# Altium schematic sheet H-bridge and gate drivers.SchDoc: H-bridge and gate drivers
size Letter; DrawnBy: K Hong; SheetNumber: 1; SheetTotal: 2
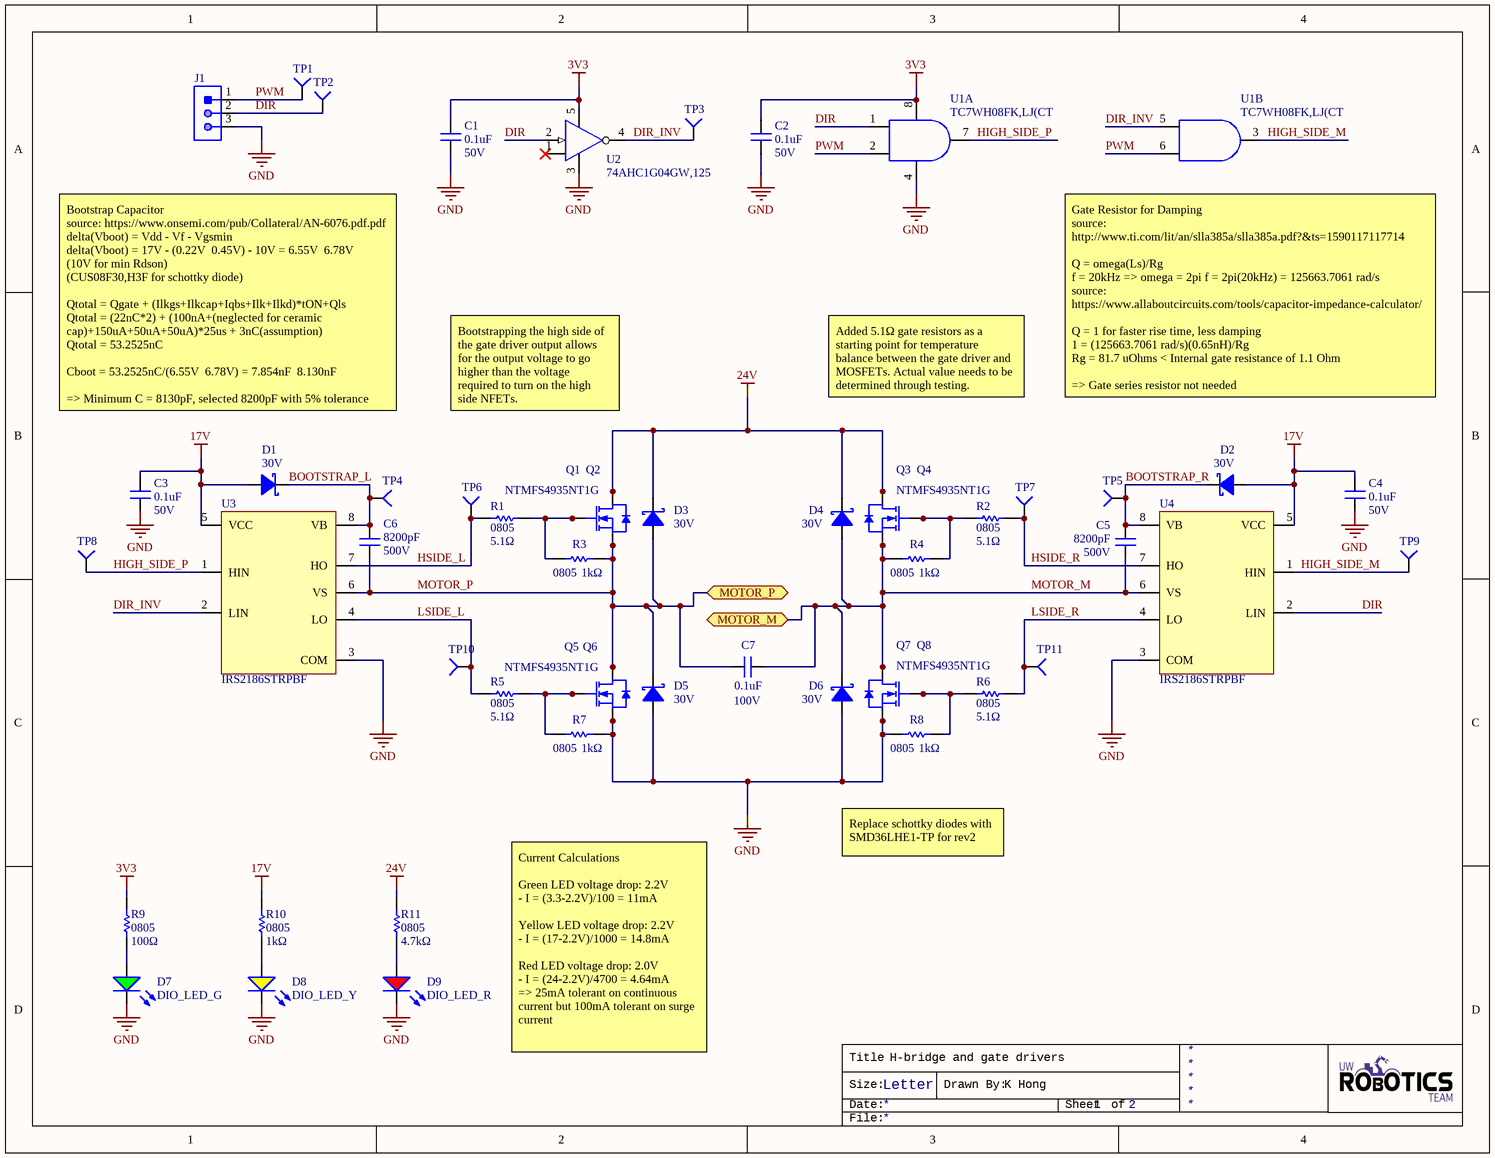
[diagram p0: H-bridge and gate drivers.SchDoc]

## Parts
C1  value 0.1uF  Voltage Rating: 50V  [CAPC2012X140N]  (hidden comment: CAP_0.1uF_50V_0805)
C2  value 0.1uF  Voltage Rating: 50V  [CAPC2012X140N]  (hidden comment: CAP_0.1uF_50V_0805)
C3  value 0.1uF  Voltage Rating: 50V  [CAPC2012X140N]  (hidden comment: CAP_0.1uF_50V_0805)
C4  value 0.1uF  Voltage Rating: 50V  [CAPC2012X140N]  (hidden comment: CAP_0.1uF_50V_0805)
C5  Capacitance: 8200pF  Voltage Rating (DC): 500V  [CAPC1206(3216)]  (hidden comment: CAP_8200pF_500V_1206)
C6  Capacitance: 8200pF  Voltage Rating (DC): 500V  [CAPC1206(3216)]  (hidden comment: CAP_8200pF_500V_1206)
C7  Capacitance: 0.1uF  Voltage(DC): 100V  [MKS2D031001A00MSSD]  (hidden comment: CAP_0.1uF_100V_FILM)
D1  Vr (Max): 30V  [SOD-323_UNIDIR]  (hidden comment: DIO_SCHOTTKY_30V_800mA)
D2  Vr (Max): 30V  [SOD-323_UNIDIR]  (hidden comment: DIO_SCHOTTKY_30V_800mA)
D3  Vr (Max): 30V  [SOD-323_UNIDIR]  (hidden comment: DIO_SCHOTTKY_30V_800mA)
D4  Vr (Max): 30V  [SOD-323_UNIDIR]  (hidden comment: DIO_SCHOTTKY_30V_800mA)
D5  Vr (Max): 30V  [SOD-323_UNIDIR]  (hidden comment: DIO_SCHOTTKY_30V_800mA)
D6  Vr (Max): 30V  [SOD-323_UNIDIR]  (hidden comment: DIO_SCHOTTKY_30V_800mA)
D7  DIO_LED_G  [LED_0805_LINE]
D8  DIO_LED_Y  [LED_0805_LINE]
D9  DIO_LED_R  [LED_0805_LINE]
J1  CON_3M_TERM  [1935174]  (value not drawn)
Q1  NTMFS4935NT1G  [SO8-FL]  (value not drawn)
Q2  NTMFS4935NT1G  [SO8-FL]
Q3  NTMFS4935NT1G  [SO8-FL]
Q4  NTMFS4935NT1G  [SO8-FL]  (value not drawn)
Q5  NTMFS4935NT1G  [SO8-FL]  (value not drawn)
Q6  NTMFS4935NT1G  [SO8-FL]
Q7  NTMFS4935NT1G  [SO8-FL]  (value not drawn)
Q8  NTMFS4935NT1G  [SO8-FL]
R1  value 5.1Ω  Case Code (Imperial): 0805  [RESC2013X70X40LL20T20]  (hidden comment: RES_5.1Ω_0805)
R2  value 5.1Ω  Case Code (Imperial): 0805  [RESC2013X70X40LL20T20]  (hidden comment: RES_5.1Ω_0805)
R3  value 1kΩ  Case Code (Imperial): 0805  [RESC2012X60N]  (hidden comment: RES_1kΩ_0805)
R4  value 1kΩ  Case Code (Imperial): 0805  [RESC2012X60N]  (hidden comment: RES_1kΩ_0805)
R5  value 5.1Ω  Case Code (Imperial): 0805  [RESC2013X70X40LL20T20]  (hidden comment: RES_5.1Ω_0805)
R6  value 5.1Ω  Case Code (Imperial): 0805  [RESC2013X70X40LL20T20]  (hidden comment: RES_5.1Ω_0805)
R7  value 1kΩ  Case Code (Imperial): 0805  [RESC2012X60N]  (hidden comment: RES_1kΩ_0805)
R8  value 1kΩ  Case Code (Imperial): 0805  [RESC2012X60N]  (hidden comment: RES_1kΩ_0805)
R9  value 100Ω  Case Code (Imperial): 0805  [RESC2012X60N]  (hidden comment: RES_100Ω_0805)
R10  value 1kΩ  Case Code (Imperial): 0805  [RESC2012X60N]  (hidden comment: RES_1kΩ_0805)
R11  value 4.7kΩ  Case Code (Imperial): 0805  [RESC2012X60N]  (hidden comment: RES_4.7kΩ_0805)
TP1  TESTPOINT_SMD  [TESTPOINT]  (value not drawn)
TP2  TESTPOINT_SMD  [TESTPOINT]  (value not drawn)
TP3  TESTPOINT_SMD  [TESTPOINT]  (value not drawn)
TP4  TESTPOINT_SMD  [TESTPOINT]  (value not drawn)
TP5  TESTPOINT_SMD  [TESTPOINT]  (value not drawn)
TP6  TESTPOINT_SMD  [TESTPOINT]  (value not drawn)
TP7  TESTPOINT_SMD  [TESTPOINT]  (value not drawn)
TP8  TESTPOINT_SMD  [TESTPOINT]  (value not drawn)
TP9  TESTPOINT_SMD  [TESTPOINT]  (value not drawn)
TP10  TESTPOINT_SMD  [TESTPOINT]  (value not drawn)
TP11  TESTPOINT_SMD  [TESTPOINT]  (value not drawn)
U1  TC7WH08FK,LJ(CT  [8-VFSOP]  (parts A,B of 2)
U2  74AHC1G04GW,125  [SOT353]
U3  IRS2186STRPBF  [8-SOIC_M]
U4  IRS2186STRPBF  [8-SOIC_M]

## Ports
MOTOR_M (bidir), MOTOR_P (bidir)

## Nets
3V3: C1.2 C2.2 R9.2 U1.8(Vcc) U2.5(Vcc)
17V: C3.2 C4.2 D1.1(Anode) D2.1(Anode) R10.2 U3.5(VCC) U4.5(VCC)
24V: D3.2(Cathode) D4.2(Cathode) Q1.3(Drain) Q2.3(Drain) Q3.3(Drain) Q4.3(Drain) R11.2
GND: C1.1 C2.1 C3.1 C4.1 D5.1(Anode) D6.1(Anode) D7.2(K) D8.2(K) D9.2(K) J1.3 Q5.1(Source) Q6.1(Source) Q7.1(Source) Q8.1(Source) R7.2 R8.1 U1.4(GND) U2.3(GND) U3.3(COM) U4.3(COM)
BOOTSTRAP_L: C6.2 D1.2(Cathode) TP4.1(=value) U3.8(VB)
BOOTSTRAP_R: C5.2 D2.2(Cathode) TP5.1(=value) U4.8(VB)
DIR: J1.2 TP2.1(=value) U1.1(A1) U2.2(A) U4.2(LIN)
DIR_INV: TP3.1(=value) U1.5(A2) U2.4(Y) U3.2(LIN)
HIGH_SIDE_M: TP9.1(=value) U1.3(Y2) U4.1(HIN)
HIGH_SIDE_P: TP8.1(=value) U1.7(Y1) U3.1(HIN)
HSIDE_L: R1.1 TP6.1(=value) U3.7(HO)
HSIDE_R: R2.2 TP7.1(=value) U4.7(HO)
LSIDE_L: R5.1 TP10.1(=value) U3.4(LO)
LSIDE_R: R6.2 TP11.1(=value) U4.4(LO)
MOTOR_M: C5.1 C7.2 D4.1(Anode) D6.2(Cathode) Q3.1(Source) Q4.1(Source) Q7.3(Drain) Q8.3(Drain) R4.1 U4.6(VS) ; port MOTOR_M
MOTOR_P: C6.1 C7.1 D3.1(Anode) D5.2(Cathode) Q1.1(Source) Q2.1(Source) Q5.3(Drain) Q6.3(Drain) R3.2 U3.6(VS) ; port MOTOR_P
PWM: J1.1 TP1.1(=value) U1.2(B1) U1.6(B2)
NetD7_1: D7.1(A) R9.1
NetD8_1: D8.1(A) R10.1
NetD9_1: D9.1(A) R11.1
NetQ1_2: Q1.2(Gate) Q2.2(Gate) R1.2 R3.1
NetQ3_2: Q3.2(Gate) Q4.2(Gate) R2.1 R4.2
NetQ5_2: Q5.2(Gate) Q6.2(Gate) R5.2 R7.1
NetQ7_2: Q7.2(Gate) Q8.2(Gate) R6.1 R8.2

Not connected (* = marked no-connect by the designer): U2 1(NC)*

## Notes on the sheet
- Bootstrap Capacitor
  source: https://www.onsemi.com/pub/Collateral/AN-6076.pdf.pdf
  delta(Vboot) = Vdd - Vf - Vgsmin
  delta(Vboot) = 17V - (0.22V  0.45V) - 10V = 6.55V  6.78V
  (10V for min Rdson)
  (CUS08F30,H3F for schottky diode)
  Qtotal = Qgate + (Ilkgs+Ilkcap+Iqbs+Ilk+Ilkd)*tON+Qls
  Qtotal = (22nC*2) + (100nA+(neglected for ceramic cap)+150uA+50uA+50uA)*25us + 3nC(assumption)
  Qtotal = 53.2525nC
  Cboot = 53.2525nC/(6.55V  6.78V) = 7.854nF  8.130nF
  => Minimum C = 8130pF, selected 8200pF with 5% tolerance
- Bootstrapping the high side of the gate driver output allows for the output voltage to go higher than the voltage required to turn on the high side NFETs.
- Added 5.1Ω gate resistors as a starting point for temperature balance between the gate driver and MOSFETs. Actual value needs to be determined through testing.
- (near U1) Gate Resistor for Damping
  source: http://www.ti.com/lit/an/slla385a/slla385a.pdf?&ts=1590117117714
  Q = omega(Ls)/Rg
  f = 20kHz => omega = 2pi f = 2pi(20kHz) = 125663.7061 rad/s
  source: https://www.allaboutcircuits.com/tools/capacitor-impedance-calculator/
  Q = 1 for faster rise time, less damping
  1 = (125663.7061 rad/s)(0.65nH)/Rg
  Rg = 81.7 uOhms < Internal gate resistance of 1.1 Ohm
  => Gate series resistor not needed
- Replace schottky diodes with SMD36LHE1-TP for rev2
- Current Calculations
  Green LED voltage drop: 2.2V
  - I = (3.3-2.2V)/100 = 11mA
  Yellow LED voltage drop: 2.2V
  - I = (17-2.2V)/1000 = 14.8mA
  Red LED voltage drop: 2.0V
  - I = (24-2.2V)/4700 = 4.64mA
  => 25mA tolerant on continuous current but 100mA tolerant on surge current
- Title
- Size:
- Date:
- Letter
- Drawn By:
- Sheet
- of
- File:

## Library data of the parts
C1-C4 = CAP_0.1uF_50V_0805: CAP CER 0.1UF 50V X7R 0805; Manufacturer 1: Murata Electronics; Manufacturer Part Number 1: GCD21BR71H104KA01L; Capacitance: 100nF; Tolerance: 10%; Mount: Surface Mount; Case/Package: 0805; Case Code (Metric): 2012; Case Code (Imperial): 0805; Min Operating Temperature: -55°C; Max Operating Temperature: 125°C; Dielectric: X7R; Termination: SMD/SMT; Length: 2mm; Height: 1.25mm; Width: 0.049inch; Thickness: 0.049inch; Depth: 1.25mm; Ratings: AEC-Q200; ComponentLink1URL: https://datasheet.ciiva.com/29537/c03e-29537701.pdf?src-supplier=Digi-Key; ComponentLink1Description: https://datasheet.ciiva.com/29537/c03e-29537701.pdf?src-supplier=Digi-Key; Supplier 1: Digi-Key; Supplier Part Number 1: 490-11955-1-ND
C5 C6 = CAP_8200pF_500V_1206: Cap 0.0082uF 500Vdc C0G 5% SMD 1206 125°C Paper T/R; Manufacturer 1: KEMET; Manufacturer Part Number 1: C1206C822JCGACAUTO; Supplier 1: Digi-Key; RoHS: No; Category: Ceramic Capacitors; Stock 1: 2611; Pricing 1: 1=0.45000, 10=0.31800, 100=0.20960, 500=0.15528, 1000=0.13198 (USD); Tolerance: 5%; ComponentLink1URL: https://datasheet.ciiva.com:443/pdfs/VipMasterIC/IC/KEME/KEME-S-A0008958438/KEME-S-A0008958438-1.pdf?src-supplier=IHS+Markit; ComponentLink1Description: https://datasheet.ciiva.com:443/pdfs/VipMasterIC/IC/KEME/KEME-S-A0008958438/KEME-S-A0008958438-1.pdf?src-supplier=IHS+Markit; Supplier Part Number 1: 399-14847-1-ND; ComponentLink2URL: http://www.farnell.com/datasheets/2746514.pdf?src-supplier=Farnell; ComponentLink2Description: http://www.farnell.com/datasheets/2746514.pdf?src-supplier=Farnell; ComponentLink3URL: http://www.farnell.com/datasheets/2746514.pdf?src-supplier=Newark; ComponentLink3Description: http://www.farnell.com/datasheets/2746514.pdf?src-supplier=Newark; Package: 1206
C7 = CAP_0.1uF_100V_FILM: CAP FILM 0.1UF 100V RADIAL; Manufacturer 1: WIMA; Tolerance: 20%; Dielectric: PET; Lead Diameter: 0.5mm; Voltage(AC): 63V; Case/Package: Radial; Min Operating Temperature: -55°C; Max Operating Temperature: 100°C; Length: 7.2mm; Depth: 2.5mm; ComponentLink1URL: https://datasheet.ciiva.com:443/pdfs/VipMasterIC/IC/WIMA/WIMA-S-A0007419204/WIMA-S-A0007419204-1.pdf?src-supplier=IHS+Markit; ComponentLink1Description: https://datasheet.ciiva.com:443/pdfs/VipMasterIC/IC/WIMA/WIMA-S-A0007419204/WIMA-S-A0007419204-1.pdf?src-supplier=IHS+Markit; Supplier 1: Digi-Key; Supplier Part Number 1: 1928-1656-ND; Manufacturer Part Number 1: MKS2D031001A00MSSD; RoHS: Yes; Category: Film Capacitors; Stock 1: 4135; Pricing 1: 1=0.43000, 10=0.30000, 100=0.17970, 500=0.13478, 1000=0.11381, 2500=0.10782, 5000=0.10183 (USD); Packaging: Bulk; Lead Pitch: 5mm; Radiation Hardening: No; ComponentLink2URL: https://datasheet.ciiva.com/26863/getdatasheetpartid-403283-26863662.pdf?src-supplier=Verical; ComponentLink2Description: https://datasheet.ciiva.com/26863/getdatasheetpartid-403283-26863662.pdf?src-supplier=Verical
D1-D6 = DIO_SCHOTTKY_30V_800mA: DIODE SCHOTTKY 30V 800MA USC; Manufacturer 1: Toshiba Semiconductor and Storage; Manufacturer Part Number 1: CUS08F30,H3F; Vf (Max): 220mV; Supplier 1: Digi-Key; Supplier Part Number 1: CUS08F30H3FCT-ND; Mount: Surface Mount; Io: 800mA
D7 = DIO_LED_G: LED GREEN DIFFUSED 0805 SMD; Manufacturer Part Number 1: LG R971-KN-1; Manufacturer 1: OSRAM; Forward Voltage Drop: 2.2V; Package: 0805 (2012 Metric); Supplier Part Number 1: 475-1410-1-ND; Supplier 1: Digi-Key; Mount: Surface Mount
D8 = DIO_LED_Y: LED YELLOW DIFFUSED 0805 SMD; Manufacturer Part Number 1: LY R976-PS-36; Manufacturer 1: OSRAM; Forward Voltage Drop: 2.2V; Package: 0805 (2012 Metric); Supplier Part Number 1: 475-2560-1-ND; Supplier 1: Digi-Key; Mount: Surface Mount
D9 = DIO_LED_R: LED RED DIFFUSED 0805 SMD; Manufacturer Part Number 1: LS R976-NR-1; Manufacturer 1: OSRAM; Forward Voltage Drop: 2V; Package: 0805 (2012 Metric); Supplier Part Number 1: 475-1278-1-ND; Supplier 1: Digi-Key; Mount: Surface Mount
J1 = CON_3M_TERM: TERM BLK 3POS SIDE ENTRY 5MM; Manufacturer 1: Phoenix Contact; Number of Contacts: 3; Voltage Rating (DC): 320V; Number of Levels: 1; Current: 18A; Voltage: 300V; Max Current Rating: 16A; Voltage Rating: 250V; Current Rating: 17.5A; Wire Gauge (Max): 26AWG; Wire Gauge (Min): 12AWG; Approvals: UL,VDE,CB; Supplier 1: Digi-Key; Supplier Part Number 1: 277-1578-ND; Manufacturer Part Number 1: 1935174; Mount: Through Hole; RoHS: Yes; Category: Terminal Blocks; Stock 1: 25144; Pricing 1: 1=0.60000, 10=0.58000, 50=0.55440, 100=0.53930, 250=0.50400, 500=0.46368, 1000=0.42840, 2500=0.42838 (USD); Number of Pins: 3; Weight: 0.100531oz; Contact Material: Copper,Tin; Color: Green; Insulation Material: Nylon; Housing Material: Polyamide; Material: Nylon; Housing Color: Green; Termination: Solder; Packaging: Bulk; Orientation: Straight; Number of Positions Per Level: 3; Number of Positions: 3; Number of Circuits: 3; Package Quantity: 250; Number of Poles: 3; Number of Rows: 1; Max Supply Voltage: 250V; Length: 9mm; Height: 11.3mm; Pitch: 5mm; Depth: 9mm; Stripping Length: 5mm; Width: 15mm; Wire/Cable Gauge: 26AWG; Radiation Hardening: No; REACH SVHC: Unknown; Flammability Rating: UL94 V-0; Lead Free: Lead Free; ComponentLink1URL: https://datasheet.ciiva.com:443/pdfs/VipMasterIC/IC/PCON/PCON-S-A0007661889/PCON-S-A0008047997-1.pdf?src-supplier=IHS+Markit; ComponentLink1Description: https://datasheet.ciiva.com:443/pdfs/VipMasterIC/IC/PCON/PCON-S-A0007661889/PCON-S-A0008047997-1.pdf?src-supplier=IHS+Markit; ComponentLink2URL: https://datasheet.ciiva.com/16047/1935174-16047249.pdf?src-supplier=Onlinecomponents.com; ComponentLink2Description: https://datasheet.ciiva.com/16047/1935174-16047249.pdf?src-supplier=Onlinecomponents.com; ComponentLink3URL: https://datasheet.ciiva.com/15169/getdatasheetpartid-212213-15169949.pdf?src-supplier=Verical; ComponentLink3Description: https://datasheet.ciiva.com/15169/getdatasheetpartid-212213-15169949.pdf?src-supplier=Verical; ComponentLink4URL: https://datasheet.ciiva.com/823/combiconcompact5-0mmseries-823761.pdf?src-supplier=Digi-Key; ComponentLink4Description: https://datasheet.ciiva.com/823/combiconcompact5-0mmseries-823761.pdf?src-supplier=Digi-Key; ComponentLink5URL: https://datasheet.ciiva.com/29218/744167-da-01-en-printklemme-pt-1-5-3-5-0-h-29218252.pdf?src-supplier=Conrad; ComponentLink5Description: https://datasheet.ciiva.com/29218/744167-da-01-en-printklemme-pt-1-5-3-5-0-h-29218252.pdf?src-supplier=Conrad
Q1-Q8 = NTMFS4935NT1G: MOSFET N-CH 30V 13A SO8FL; Manufacturer 1: ON Semiconductor; Continuous Drain Current (ID): 93A; Drain to Source Resistance: 3.2mR; Power Dissipation: 2.63W; Max Power Dissipation: 48W; Threshold Voltage: 1.63V; Turn-On Delay Time: 16.3ns; Turn-Off Delay Time: 27.5ns; Fall Time: 6.6ns; Number of Elements: 1; Input Capacitance: 4.85nF; Rise Time: 20ns; Element Configuration: Single; Gate to Source Voltage (Vgs): 20V; Supplier 1: Digi-Key; RoHS: Yes; Category: MOSFETs; Stock 1: 10192; Pricing 1: 1=0.87000, 10=0.76800, 25=0.72160, 100=0.52380, 250=0.50516, 500=0.43766 (USD); Case/Package: SO; Number of Pins: 5; Contact Plating: Tin,Matte; Min Operating Temperature: -55°C; Max Operating Temperature: 150°C; Drain to Source Breakdown Voltage: 30V; Drain to Source Voltage (Vdss): 30V; Nominal Vgs: 1.63V; Package Quantity: 1; Rds On Max: 3.2mR; Packaging: Tape and Reel; Length: 5.1mm; Height: 1.1mm; Width: 6.1mm; Radiation Hardening: No; Lead Free: Lead Free; REACH SVHC: No SVHC; ComponentLink1URL: https://datasheet.ciiva.com:443/pdfs/VipMasterIC/IC/ONSM/ONSM-S-A0008367025/ONSM-S-A0008367025-1.pdf?src-supplier=IHS+Markit; ComponentLink1Description: https://datasheet.ciiva.com:443/pdfs/VipMasterIC/IC/ONSM/ONSM-S-A0008367025/ONSM-S-A0008367025-1.pdf?src-supplier=IHS+Markit; ComponentLink2URL: https://datasheet.ciiva.com/22641/1707323-22641681.pdf?src-supplier=Element14; ComponentLink2Description: https://datasheet.ciiva.com/22641/1707323-22641681.pdf?src-supplier=Element14; ComponentLink3URL: https://datasheet.ciiva.com/947/ntmfs4935n-d-947308.pdf?src-supplier=Digi-Key; ComponentLink3Description: https://datasheet.ciiva.com/947/ntmfs4935n-d-947308.pdf?src-supplier=Digi-Key; ComponentLink4URL: https://datasheet.ciiva.com/11166/ntmfs4935n-d-11166461.pdf?src-supplier=Avnet; ComponentLink4Description: https://datasheet.ciiva.com/11166/ntmfs4935n-d-11166461.pdf?src-supplier=Avnet; ComponentLink5URL: https://datasheet.ciiva.com/947/ntmfs4935n-d-947310.pdf?src-supplier=Digi-Key; ComponentLink5Description: https://datasheet.ciiva.com/947/ntmfs4935n-d-947310.pdf?src-supplier=Digi-Key; ComponentLink6URL: https://datasheet.ciiva.com/947/ntmfs4935n-d-947309.pdf?src-supplier=Digi-Key; ComponentLink6Description: https://datasheet.ciiva.com/947/ntmfs4935n-d-947309.pdf?src-supplier=Digi-Key; Supplier Part Number 1: NTMFS4935NT1GOSCT-ND
  Q2 Q3 Q6 Q8: Manufacturer Part Number 1: NTMFS4935NT1G
R1 R2 R5 R6 = RES_5.1Ω_0805: RES SMD 5.1 OHM 5% 1/8W 0805; Manufacturer 1: Panasonic; Manufacturer Part Number 1: ERJ-6GEYJ5R1V; Supplier 1: Digi-Key; Supplier Part Number 1: P5.1ACT-ND; Mount: Surface Mount; Case Code (Metric): 2012
R3 R4 R7 R8 R10 = RES_1kΩ_0805: RES SMD 1K OHM 1% 1/8W 0805; Manufacturer 1: Yageo; Manufacturer Part Number 1: RC0805FR-071KL; Power Rating: 125mW; Supplier 1: Digi-Key; Case Code (Metric): 2012; Min Operating Temperature: -55°C; Max Operating Temperature: 155°C; Resistance: 1K; Tolerance: 1%; Termination: SMD/SMT; Supplier Part Number 1: 311-1.00KCRCT-ND
R9 = RES_100Ω_0805: RES SMD 100 OHM 1% 1/8W 0805; Manufacturer 1: Yageo; Manufacturer Part Number 1: RC0805FR-07100RL; Power Rating: 125mW; Supplier 1: Digi-Key; Mount: Surface Mount; Case Code (Metric): 2012; Supplier Part Number 1: 311-100CRCT-ND
R11 = RES_4.7kΩ_0805: RES SMD 4.7K OHM 5% 1/8W 0805; Manufacturer 1: Yageo; Manufacturer Part Number 1: RC0805JR-074K7L; Resistance: 4.7kR; Power Rating: 125mW; Temperature Coefficient: 100ppm/°C; Voltage Rating: 150V; Supplier 1: Digi-Key; Case Code (Metric): 2012; Min Operating Temperature: -55°C; Max Operating Temperature: 155°C; Tolerance: 5%; Termination: SMD/SMT; Supplier Part Number 1: 311-4.7KARCT-ND; Stock 1: 2755291; Pricing 1: 1=0.10000, 10=0.03500, 100=0.01400, 1000=0.00631, 2500=0.00548 (USD); RoHS: Yes; Case/Package: Molded; Contact Plating: Tin,Lead,Matte; Packaging: Tape and Reel; Composition: Thick Film; Military Standard: Not; Length: 2mm; Depth: 1.25mm; Radiation Hardening: No; REACH SVHC: Unknown; Lead Free: Lead Free; ComponentLink1URL: https://datasheet.ciiva.com/7941/442941-7941973.pdf?src-supplier=Element14; ComponentLink1Description: https://datasheet.ciiva.com/7941/442941-7941973.pdf?src-supplier=Element14; ComponentLink2URL: https://datasheet.ciiva.com/7941/442941-7941974.pdf?src-supplier=Element14; ComponentLink2Description: https://datasheet.ciiva.com/7941/442941-7941974.pdf?src-supplier=Element14; ComponentLink3URL: https://datasheet.ciiva.com/17486/rc0805-17486827.pdf?src-supplier=Future+Electronics; ComponentLink3Description: https://datasheet.ciiva.com/17486/rc0805-17486827.pdf?src-supplier=Future+Electronics; ComponentLink4URL: https://datasheet.ciiva.com/12667/rc0805-12667037.pdf?src-supplier=Mouser; ComponentLink4Description: https://datasheet.ciiva.com/12667/rc0805-12667037.pdf?src-supplier=Mouser; Mount: Surface Mount
U1 = TC7WH08FK,LJ(CT: AND Gate 2-Element 2-IN CMOS Automotive 8-Pin SSOP T/R; Manufacturer 1: Toshiba; Number of Circuits: 2; Quiescent Current: 2uA; High Level Output Current: 8mA; Propagation Delay: 7.9ns; Supplier 1: Digi-Key; RoHS: Yes; Category: Logic Gates; Stock 1: 703; Pricing 1: 1=0.41000, 10=0.30500, 25=0.27520, 100=0.19000, 250=0.16000, 500=0.13000, 1000=0.10000 (USD); Mount: Surface Mount; Number of Pins: 8; Min Operating Temperature: -40°C; Max Operating Temperature: 85°C; Logic Function: AND; Packaging: Tape and Reel; Number of Inputs: 2; Low Level Output Current: 8mA; ComponentLink1URL: https://datasheet.ciiva.com:443/pdfs/VipMasterIC/IC/TOSC/TOSC-S-A0002811544/TOSC-S-A0002811544-1.pdf?src-supplier=IHS+Markit; ComponentLink1Description: https://datasheet.ciiva.com:443/pdfs/VipMasterIC/IC/TOSC/TOSC-S-A0002811544/TOSC-S-A0002811544-1.pdf?src-supplier=IHS+Markit; ComponentLink2URL: http://www.mouser.com/ds/2/408/TC7WH08FU_datasheet_en_20170424-1144181.pdf?src-supplier=Mouser; ComponentLink2Description: http://www.mouser.com/ds/2/408/TC7WH08FU_datasheet_en_20170424-1144181.pdf?src-supplier=Mouser; ComponentLink3URL: https://toshiba.semicon-storage.com/info/docget.jsp?did=20117&prodName=TC7WH08FU&src-supplier=Digi-Key; ComponentLink3Description: https://toshiba.semicon-storage.com/info/docget.jsp?did=20117&prodName=TC7WH08FU&src-supplier=Digi-Key; Supplier Part Number 1: TC7WH08FKLJ(CTCT-ND; Manufacturer Part Number 1: TC7WH08FK,LJ(CT
U2 = 74AHC1G04GW,125: 74AHC Series 5 V High Speed Si-Gate CMOS Inverter Buffer Surface Mount - TSSOP-5; Manufacturer 1: Nexperia; Supplier 1: Digi-Key; RoHS: No; Stock 1: 10022; Pricing 1: 1=0.21000, 10=0.17400, 25=0.14600, 100=0.09230, 250=0.07128, 500=0.06076, 1000=0.04131 (USD); ComponentLink1URL: https://datasheet.ciiva.com:443/pdfs/VipMasterIC/IC/NEXP/NEXP-S-A0003105567/NEXP-S-A0003105477-1.pdf?src-supplier=IHS+Markit; ComponentLink1Description: https://datasheet.ciiva.com:443/pdfs/VipMasterIC/IC/NEXP/NEXP-S-A0003105567/NEXP-S-A0003105477-1.pdf?src-supplier=IHS+Markit; Supplier Part Number 1: 1727-3147-1-ND; Manufacturer Part Number 1: 74AHC1G04GW,125
U3 U4 = IRS2186STRPBF: IC DRIVER HI/LO SIDE 600V 8-SOIC; Manufacturer 1: International Rectifier; Max Supply Current: 240uA; Number of Outputs: 2; Max Supply Voltage: 20V; Min Supply Voltage: 10V; Max Power Dissipation: 625mW; Fall Time: 30ns; Turn-Off Delay Time: 170ns; Rise Time: 38ns; Propagation Delay: 250ns; Max Output Current: 4A; Supplier 1: Digi-Key; RoHS: Yes; Category: Gate Drivers; Stock 1: 2450; Pricing 1: 1=1.50000, 10=1.35000, 25=1.27400, 100=1.01920, 250=0.89180, 500=0.86632, 1000=0.68796 (USD); Mount: Surface Mount; Case/Package: SOIC; Number of Pins: 8; Min Operating Temperature: -40°C; Max Operating Temperature: 125°C; Number of Drivers: 2; Turn-On Delay Time: 170ns; Power Dissipation: 625mW; Package Quantity: 1; Packaging: Tape and Reel; Output Current: 4A; Nominal Supply Current: 240uA; Radiation Hardening: No; Lead Free: Lead Free; ComponentLink1URL: https://datasheet.ciiva.com:443/pdfs/VipMasterIC/IC/IRSD/IRSD-S-A0000774532/IRSD-S-A0000774532-1.pdf?src-supplier=IHS+Markit; ComponentLink1Description: https://datasheet.ciiva.com:443/pdfs/VipMasterIC/IC/IRSD/IRSD-S-A0000774532/IRSD-S-A0000774532-1.pdf?src-supplier=IHS+Markit; ComponentLink2URL: https://datasheet.ciiva.com/1952/irs2186pbf-1952608.pdf?src-supplier=Digi-Key; ComponentLink2Description: https://datasheet.ciiva.com/1952/irs2186pbf-1952608.pdf?src-supplier=Digi-Key; ComponentLink3URL: https://datasheet.ciiva.com/16442/irs2186pbf-16442422.pdf?src-supplier=Future+Electronics; ComponentLink3Description: https://datasheet.ciiva.com/16442/irs2186pbf-16442422.pdf?src-supplier=Future+Electronics; ComponentLink4URL: https://datasheet.ciiva.com/1952/irs2186pbf-1952607.pdf?src-supplier=Digi-Key; ComponentLink4Description: https://datasheet.ciiva.com/1952/irs2186pbf-1952607.pdf?src-supplier=Digi-Key; Supplier Part Number 1: IRS2186STRPBFCT-ND; Manufacturer Part Number 1: IRS2186STRPBF
TP1-TP11 = TESTPOINT_SMD: Part Number (MPN): *